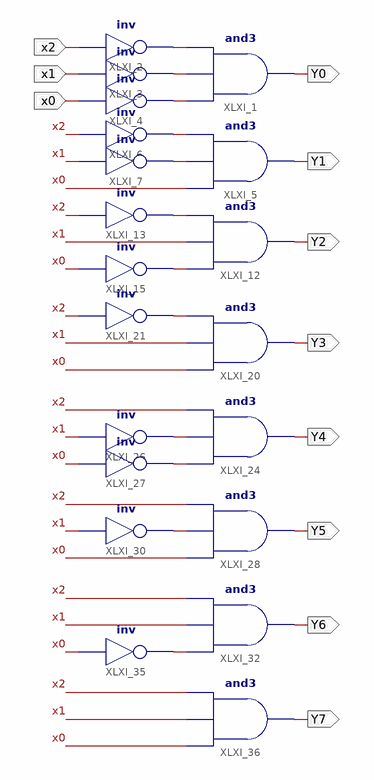
[diagram p0: schematic sheet 1]
// Xilinx ISE schematic decoder_3_to_8.sch (virtex6) as structural Verilog: 20 symbols, 11 ports
module decoder_3_to_8 (
  input  x2,
  input  x1,
  input  x0,
  output Y1,
  output Y2,
  output Y3,
  output Y4,
  output Y5,
  output Y6,
  output Y7,
  output Y0
);

  wire XLXN_1, XLXN_2, XLXN_3, XLXN_8, XLXN_9, XLXN_22, XLXN_24, XLXN_28, XLXN_32, XLXN_33, XLXN_35, XLXN_39;

  and XLXI_5 (Y1, x0, XLXN_9, XLXN_8);
  not XLXI_6 (XLXN_8, x2);
  not XLXI_7 (XLXN_9, x1);
  and XLXI_12 (Y2, XLXN_24, x1, XLXN_22);
  not XLXI_13 (XLXN_22, x2);
  not XLXI_15 (XLXN_24, x0);
  and XLXI_20 (Y3, x0, x1, XLXN_28);
  not XLXI_21 (XLXN_28, x2);
  and XLXI_24 (Y4, XLXN_33, XLXN_32, x2);
  not XLXI_26 (XLXN_32, x1);
  not XLXI_27 (XLXN_33, x0);
  and XLXI_28 (Y5, x0, XLXN_35, x2);
  not XLXI_30 (XLXN_35, x1);
  and XLXI_32 (Y6, XLXN_39, x1, x2);
  not XLXI_35 (XLXN_39, x0);
  and XLXI_36 (Y7, x0, x1, x2);
  not XLXI_4 (XLXN_3, x0);
  not XLXI_3 (XLXN_2, x1);
  not XLXI_2 (XLXN_1, x2);
  and XLXI_1 (Y0, XLXN_3, XLXN_2, XLXN_1);
endmodule
